# Altium schematic sheet RS485.SchDoc
size A1
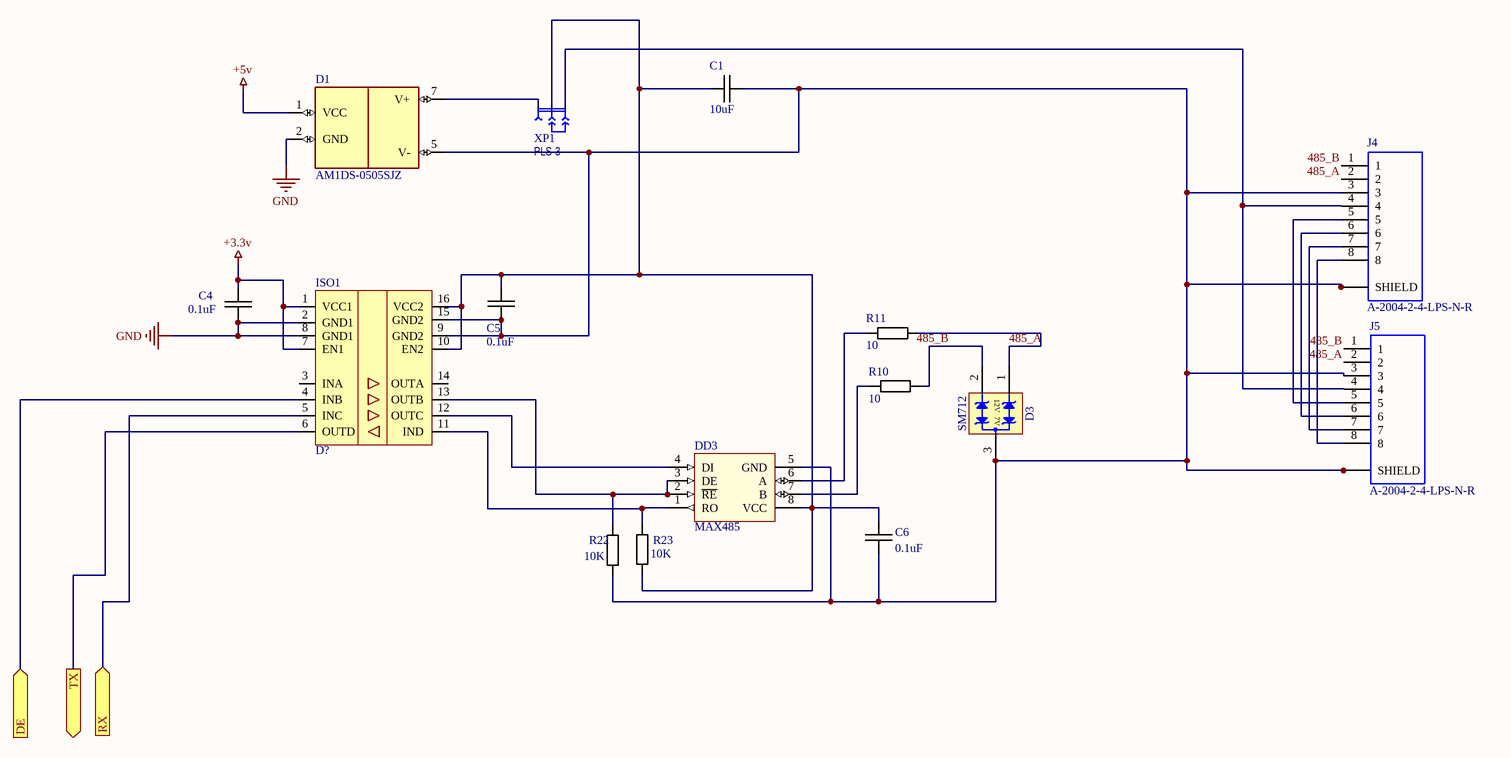
[diagram p0: RS485.SchDoc]

## Parts
C1  10uF  [CAPC3225X270N]
C4  0.1uF  [CAPACITOR 0603]
C5  0.1uF  [CAPACITOR 0603]
C6  0.1uF  [CAPACITOR 0603]
D1  AM1DS-0505SJZ  [AM2D-NZ]
D3  SM712  [SOT23]
DD3  MAX485  [NSO8]
ISO1  D?  [*SOIC127P1030X265-16N]
J4  A-2004-2-4-LPS-N-R  [ASSMANN_A-2004-2-4-LPS-N-R]
J5  A-2004-2-4-LPS-N-R  [ASSMANN_A-2004-2-4-LPS-N-R]
R10  10  [Resistor 0603]
R11  10  [Resistor 0603]
R22  10K  [Resistor 0603]
R23  10K  [Resistor 0603]
XP1  PLS-3  [ZL201-3]

## Ports
DE (in), RX (in), TX (out)

## Nets
+3.3v: C4.1 ISO1.1(VCC1) ISO1.7(EN1)
+5v: D1.1(VCC)
GND: C4.2 D1.2(GND) ISO1.2(GND1) ISO1.8(GND1)
485_A: D3.1(I/O1) J4.2 J5.2 R11.1
485_B: D3.2(I/O2) J4.1 J5.1 R10.1
DE: ISO1.4(INB) ; port DE
RX: ISO1.5(INC) ; port RX
TX: ISO1.6(OUTD) ; port TX
NetC1_1: C1.1 C5.1 C6.1 D1.5(V-) D3.3(GND) DD3.5(GND) ISO1.9(GND2) ISO1.15(GND2) J4.3 J4.S1(SHIELD) J4.S2(SHIELD) J5.3 J5.S1(SHIELD) J5.S2(SHIELD) R22.2
NetC1_2: C1.2 C5.2 C6.2 DD3.8(VCC) ISO1.10(EN2) ISO1.16(VCC2) R23.1 XP1.2
NetD1_7: D1.7(V+) XP1.3
NetDD3_1: DD3.1(RO) ISO1.11(IND) R23.2
NetDD3_2: DD3.2(~{RE}) DD3.3(DE) ISO1.13(OUTB) R22.1
NetDD3_4: DD3.4(DI) ISO1.12(OUTC)
NetDD3_6: DD3.6(A) R11.2
NetDD3_7: DD3.7(B) R10.2
NetJ4_4: J4.4 J5.4 XP1.1
NetJ4_5: J4.5 J5.5
NetJ4_6: J4.6 J5.6
NetJ4_7: J4.7 J5.7
NetJ4_8: J4.8 J5.8

Not connected (* = marked no-connect by the designer): ISO1 3(INA) 14(OUTA)

## Notes on the sheet
- (in symbol SM712) 12V; 7V

## Library data of the parts
C1 C4-C6 = Capasitor: Value: *
D3 = SM712: Asymmetrical TVS Diode for Extended Common-Mode RS-485
DD3 = MAX485: Low-Power, Slew-Rate-Limited RS-485/RS-422 Transceiver; ComponentLink1URL: http://pdfserv.maxim-ic.com/en/ds/MAX1487-MAX491.pdf; Type: MAX485
ISO1 = ISO7341
J4 J5 = A-2004-2-4-LPS-N-R: Jack Modular Connector 8p8c _RJ45, Ethernet_ 90Â° Angle _Right_ Shielded; MF: Assmann WSW; Package: None; MP: A-2004-2-4-LPS-N-R; Value: *; Price: None; Availability: Unavailable; SnapEDA_Link: https://www.snapeda.com/parts/A-2004-2-4-LPS-N-R/Assmann%20WSW%20Components/view-part/454861/?ref=snap
R10 R11 R22 R23 = Resistor: Value: *
XP1 = Select jump: Connector, 3-Pin; Class: Электронные компоненты; SubClass: Разъемы; Pitch_mm: {Pitch_mm}; Installation: DIP; Ordering_Information: {Ordering_Information}; Type_of_connector: {Type_of_connector}; Pins: 3; Value: PLS-3